# EAGLE design Esp8266_prot16_v2 (EAGLE 8.4.0)
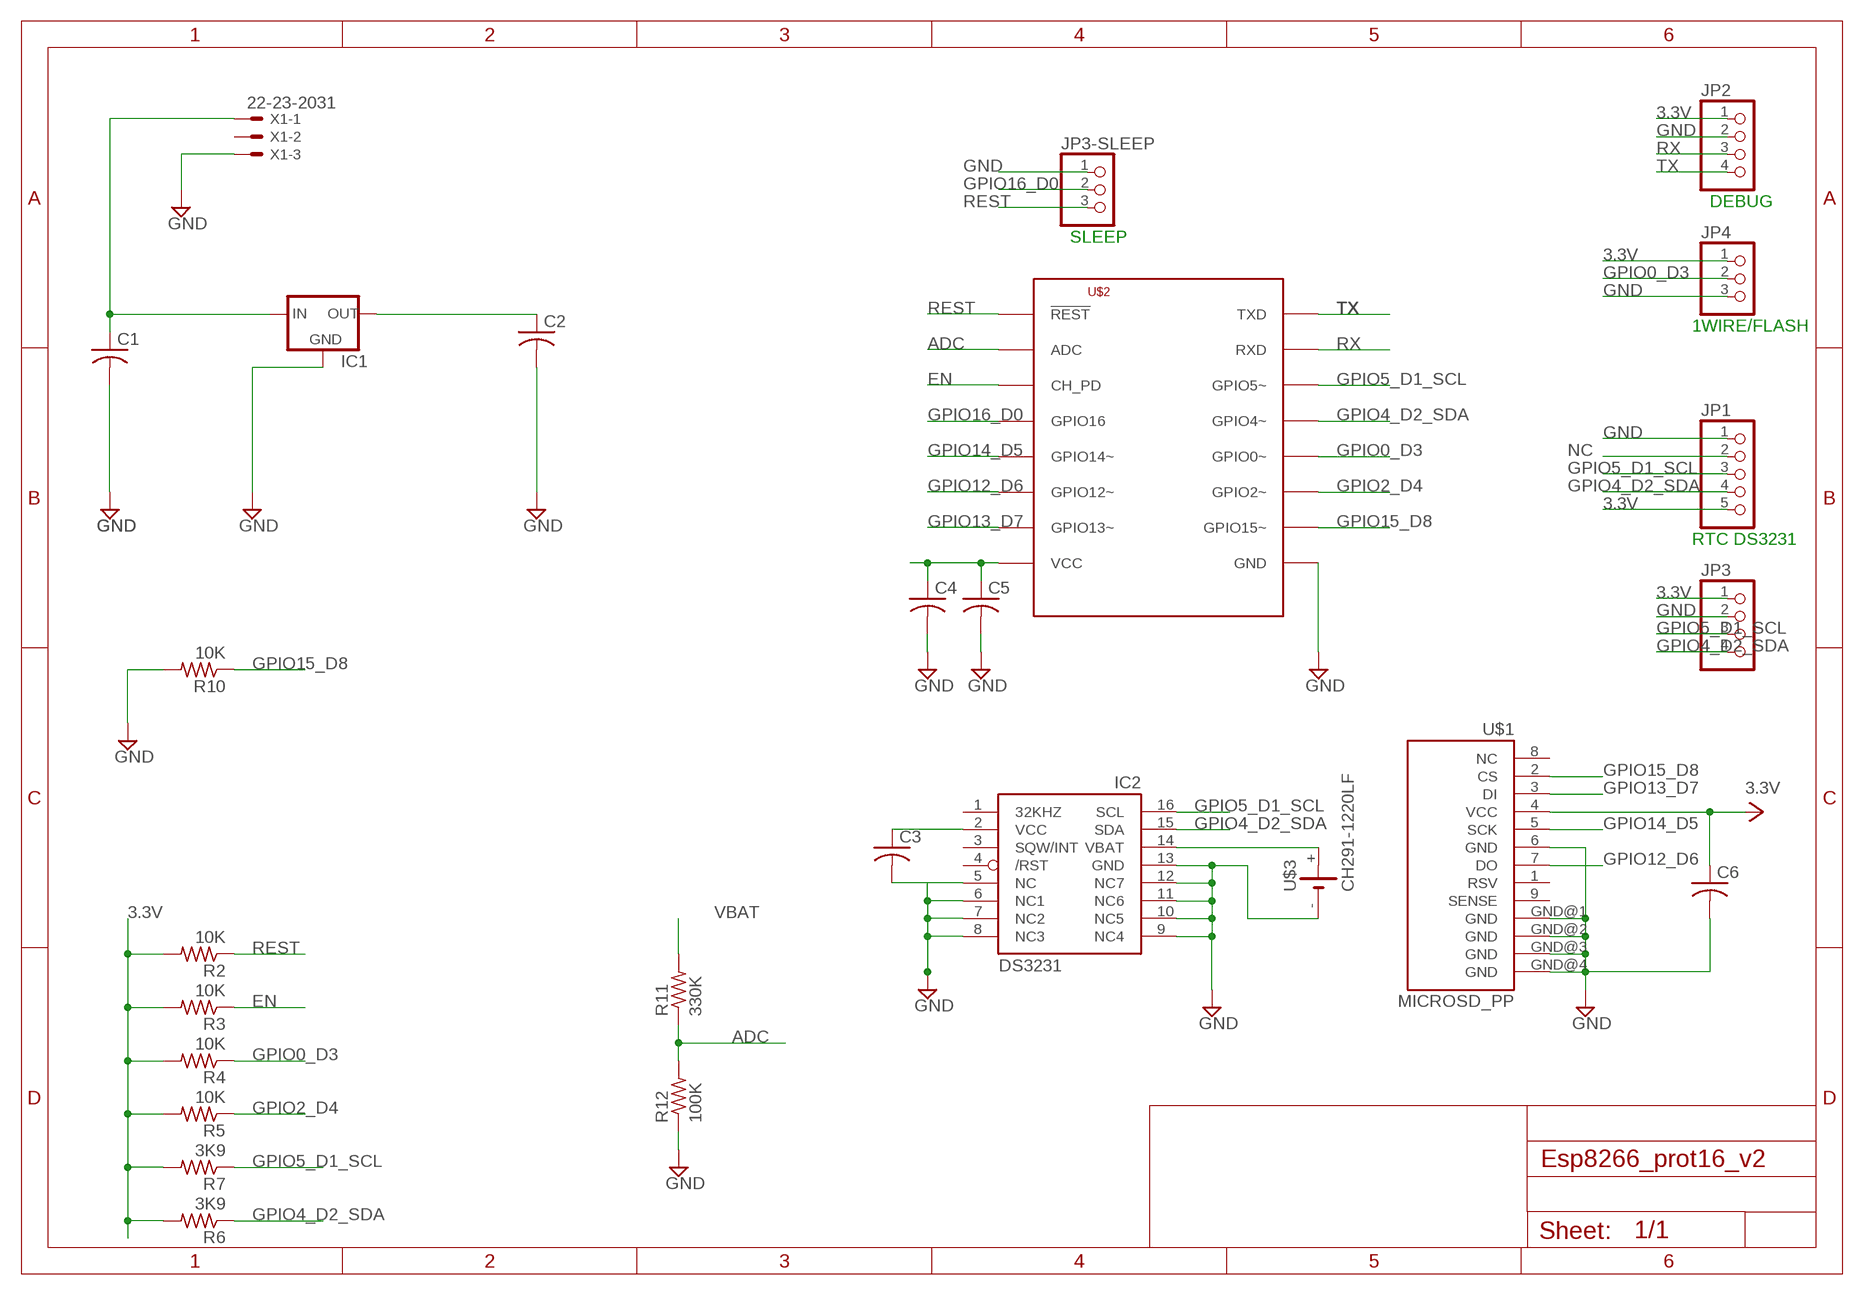
[diagram p0: schematic, sheet 1]

## Parts
C1  C-USC0805K  [C0805K]
C2  C-USC0805K  [C0805K]
C3  C-USC0805K  [C0805K]
C4  C-USC0805K  [C0805K]
C5  C-USC0805K  [C0805K]
C6  C-USC0805K  [C0805K]
IC1  XC63FPP  [SOT89R]
IC2  DS3231/SO  [SO16W]
JP1  PINHD-1X5/90  [1X05/90]
JP2  PINHD-1X4  [1X04]
JP3  PINHD-1X4/90  [1X04/90]
JP3-SLEEP  PINHD-1X3  [1X03]
JP4  PINHD-1X3  [1X03]
R2  10K  R-US_R0805  [R0805]
R3  10K  R-US_R0805  [R0805]
R4  10K  R-US_R0805  [R0805]
R5  10K  R-US_R0805  [R0805]
R6  3K9  R-US_R0805  [R0805]
R7  3K9  R-US_R0805  [R0805]
R10  10K  R-US_R0805  [R0805]
R11  330K  R-US_R0805  [R0805]
R12  100K  R-US_R0805  [R0805]
U$1  MICROSD_PP  [MICROSD_PP]
U$2  ESP8266-07  [ESP-07]
U$3  CH291-1220LF  [CH291-1220LF]
X1  22-23-2031  [22-23-2031]

## Nets
3.3V: C2.1 C3.1 C4.1 C5.1 C6.1 IC1.3(OUT) IC2.2(VCC) JP1.5 JP2.1 JP3.1 JP4.1 R2.2 R3.2 R4.2 R5.2 R6.2 R7.2 U$1.4(VCC) U$2.VCC
ADC: R11.1 R12.2 U$2.ADC
BATRTC: IC2.14(VBAT) U$3.+
EN: R3.1 U$2.CH_PD
GND: C1.2 C2.2 C3.2 C4.2 C5.2 C6.2 IC1.1(GND) IC2.5(NC) IC2.6(NC1) IC2.7(NC2) IC2.8(NC3) IC2.9(NC4) IC2.10(NC5) IC2.11(NC6) IC2.12(NC7) IC2.13(GND) JP1.1 JP2.2 JP3-SLEEP.1 JP3.2 JP4.3 R10.2 R12.1 U$1.6(GND) U$1.GND@1(GND) U$1.GND@2(GND) U$1.GND@3(GND) U$1.GND@4(GND) U$2.GND U$3.- X1.3
GPIO0_D3: JP4.2 R4.1 U$2.GPIO0(GPIO0~)
GPIO2_D4: R5.1 U$2.GPIO2(GPIO2~)
GPIO4_D2_SDA: IC2.15(SDA) JP1.4 JP3.4 R6.1 U$2.GPIO5(GPIO4~)
GPIO5_D1_SCL: IC2.16(SCL) JP1.3 JP3.3 R7.1 U$2.GPIO4(GPIO5~)
GPIO12_D6: U$1.7(DO) U$2.GPIO12(GPIO12~)
GPIO13_D7: U$1.3(DI) U$2.GPIO13(GPIO13~)
GPIO14_D5: U$1.5(SCK) U$2.GPIO14(GPIO14~)
GPIO15_D8: R10.1 U$1.2(CS) U$2.GPIO15(GPIO15~)
GPIO16_D0: JP3-SLEEP.2 U$2.GPIO16
NC: JP1.2
REST: JP3-SLEEP.3 R2.1 U$2.REST(!REST)
RX: JP2.3 U$2.RXD
TX: JP2.4 U$2.TXD
VBAT: C1.1 IC1.2(IN) R11.2 X1.1
Unconnected: IC2.1(32KHZ) IC2.3(SQW/INT) IC2.4(/RST) U$1.1(RSV) U$1.8(NC) U$1.9(SENSE) X1.2

## Notes on the sheet
- DEBUG
- SLEEP
- 1WIRE/FLASH
- RTC DS3231

## Library data of the parts
C1-C6 = adafruit:C-US: CAPACITOR, American symbol
IC1 = v-reg:XC63FP: Positiv Voltage Regulators www.torex.co.jp/english/product/pro02/pdf/0201_xc62fp.pdf
IC2 = adafruit:DS3231
JP1 = pinhead:PINHD-1X5: PIN HEADER
JP2 JP3 = pinhead:PINHD-1X4: PIN HEADER
JP3-SLEEP JP4 = pinhead:PINHD-1X3: PIN HEADER
R2-R7 R10-R12 = adafruit:R-US_: RESISTOR, American symbol
U$1 = DE1594-v2:MICROSD_PP
U$2 = lio:ESP8266
U$3 = battery:CH291-1220LF: Battery Holder, SMT, 12mm multicomp PART NO. CH291-1220LF Source: Data sheet <http://www.farnell.com/datasheets/1505860.pdf>
X1 = con-molex:22-23-2031: .100" (2.54mm) Center Header - 3 Pin; MF: MOLEX; MPN: 22-23-2031; OC_FARNELL: 1462950; OC_NEWARK: 30C0862

## Board
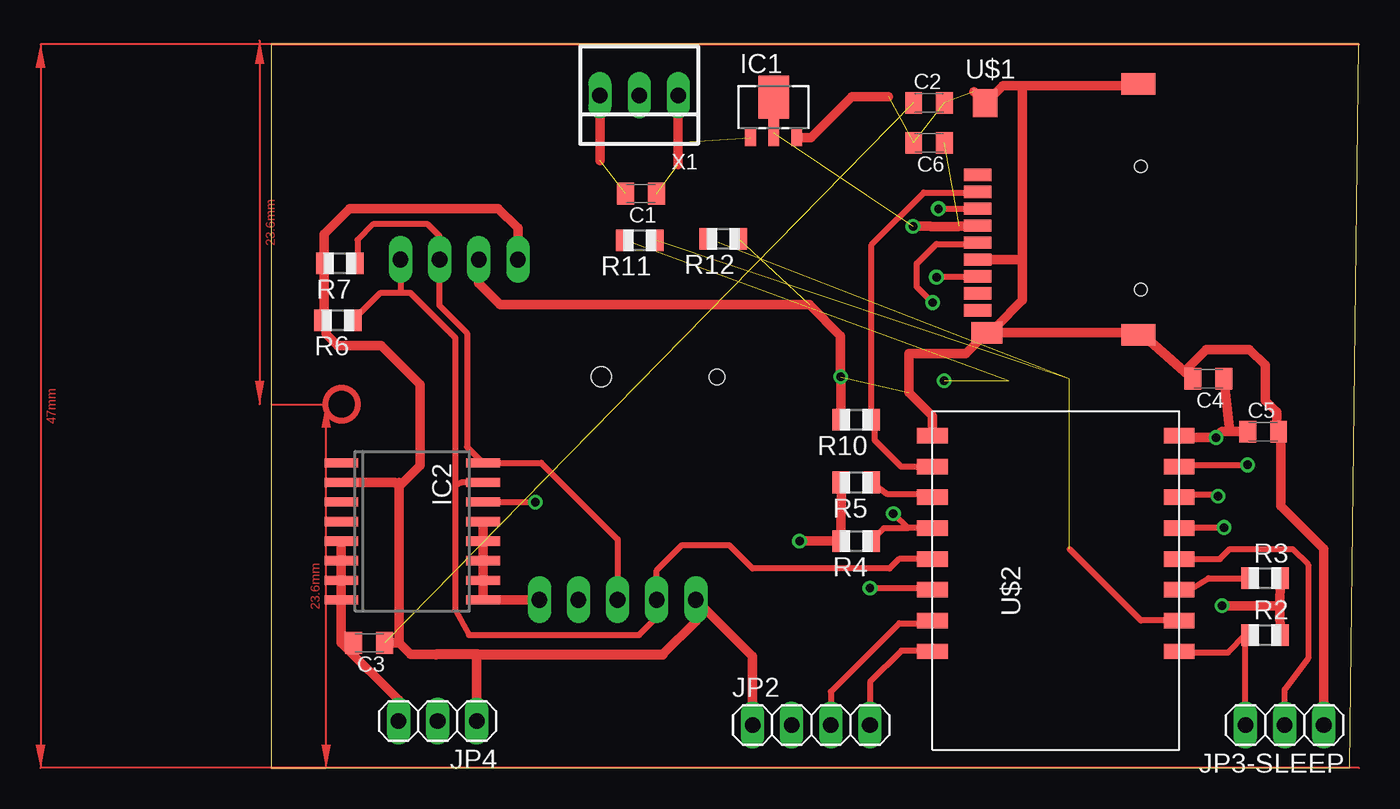
[diagram p1: board, top side]
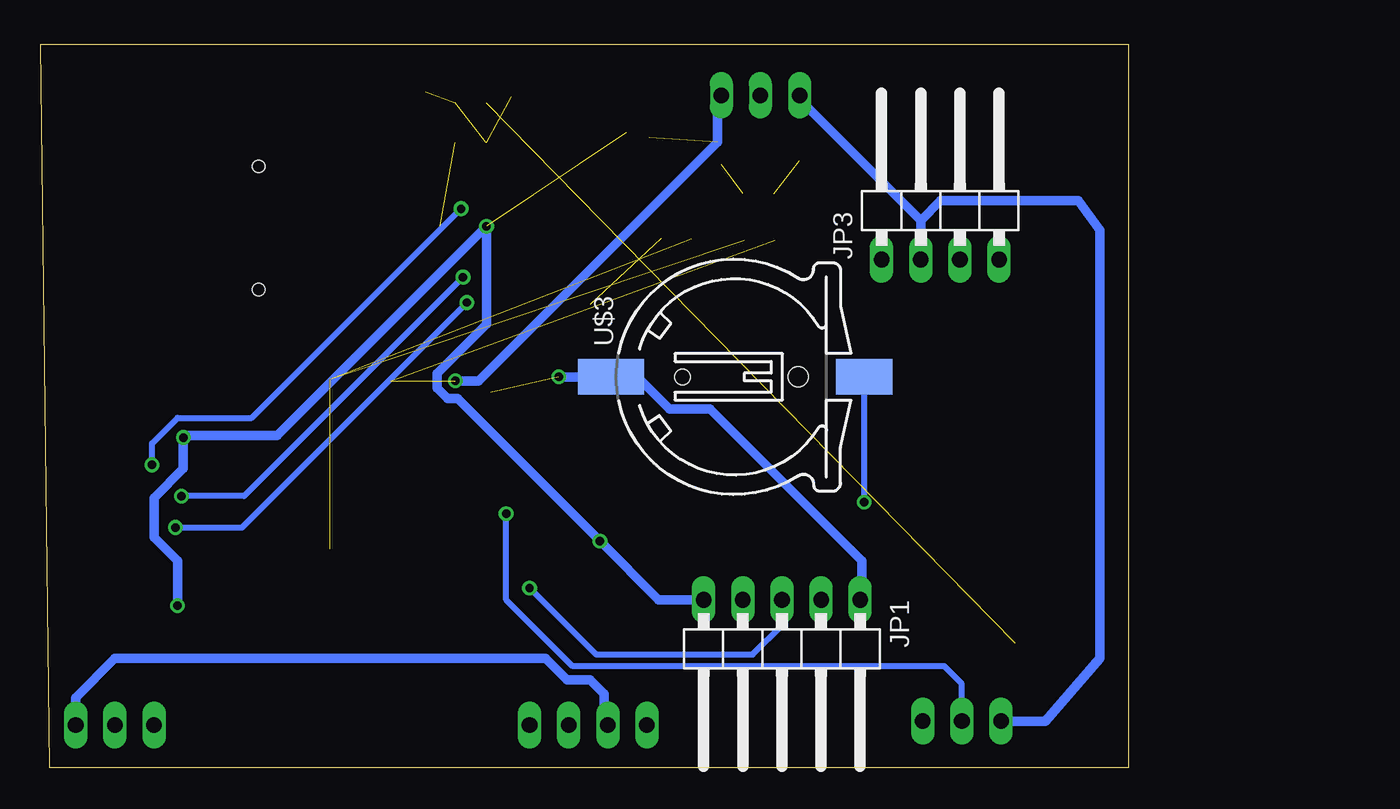
[diagram p2: board, bottom side, seen from below]

Size 70.6 x 47 mm. Coordinates in mm from the lower left corner, seen from the top.
Outline: 0,0 70,0 70.6,47 0,47 0,0
Copper layers (1*16): Top 0.035mm / dielectric 1.5mm / Bottom 0.035mm
Design rules "default *": minimum track width 15mil, minimum drill 0.55mm, track to track 15mil, track to pad 15mil, pad to pad 6mil, via to via 6mil, smd to smd 6mil, copper to edge 50mil, drill to drill 6mil, minimum pad ring 10mil, minimum via ring 8mil, stop-mask expansion 4mil, vias tented up to drill 0mil, thermal gap 10mil

### Footprints (pad centres in the part's own frame; a part is rotated, then mirrored left to right if it is on the bottom)
C0805K = smd 1.1 x 1.4: 1 -1,0; 2 1,0
SOT89R = smd 0.7 x 1.1: 1 1.5,-1.75; 2 -1.5,-1.75 | smd 0.7 x 1.8: 3 0,-1.4 | smd 2 x 2.8: 4 0,0.9
SO16W = smd 0.6 x 2.2: 1 -4.445,-4.6; 2 -3.175,-4.6; 3 -1.905,-4.6; 4 -0.635,-4.6; 5 0.635,-4.6; 6 1.905,-4.6; 7 3.175,-4.6; 8 4.445,-4.6; 9 4.445,4.6; 10 3.175,4.6; 11 1.905,4.6; 12 0.635,4.6; 13 -0.635,4.6; 14 -1.905,4.6; 15 -3.175,4.6; 16 -4.445,4.6
1X05/90 = drill 1.016 long: 1 -5.08,-3.81; 2 -2.54,-3.81; 3 0,-3.81; 4 2.54,-3.81; 5 5.08,-3.81
1X04 = drill 1.016 long: 1 -3.81,0; 2 -1.27,0; 3 1.27,0; 4 3.81,0
1X04/90 = drill 1.016 long: 1 -3.81,-3.81; 2 -1.27,-3.81; 3 1.27,-3.81; 4 3.81,-3.81
1X03 = drill 1.016 long: 1 -2.54,0; 2 0,0; 3 2.54,0
R0805 = smd 1.1 x 1.4: 1 -1,0; 2 1,0
MICROSD_PP = smd 1.8 x 0.8: 1 0,3.85; 2 0,2.75; 3 0,1.65; 4 0,0.55; 5 0,-0.55; 6 0,-1.65; 7 0,-2.75; 8 0,-3.85; 9 0,-4.95 | smd 1.6 x 1.8: GND@1 0.5,8.5 | smd 2.2 x 1.4: GND@2 10.45,9.75; GND@4 10.45,-6.55 | smd 2 x 1.4: GND@3 0.6,-6.4 | hole 0.8: 10.6,4.4; 10.6,-3.6
ESP-07 = smd 1 x 2: ADC -1.6,-8; CH_PD 0.4,-8; GND 10.4,8; GPIO0 4.4,8; GPIO2 6.4,8; GPIO4 0.4,8; GPIO5 2.4,8; GPIO12 6.4,-8; GPIO13 8.4,-8; GPIO14 4.4,-8; GPIO15 8.4,8; GPIO16 2.4,-8; REST -3.6,-8; RXD -1.6,8; TXD -3.6,8; VCC 10.4,-8
CH291-1220LF = smd 2.3 x 3.66: + 0,-2.296 | smd 2.3 x 4.3: - 0,14.146 | hole 1.3: 0,2 | hole 1: 0,9.5
22-23-2031 = drill 1 long: 1 -2.54,0; 2 0,0; 3 2.54,0

### Placement (x,y rotation side)
C1  24,37.3 180 top
C2  42.7,43.2 0 top
C3  6.35,8.13 180 top
C4  60.83,25.27 180 top
C5  64.39,21.84 0 top
C6  42.7,40.6 180 top
IC1  32.61,42.67 0 top
IC2  9.14,15.37 270 top
JP1  22.48,7.11 180 bottom
JP2  35.05,2.79 0 top
JP3  12.19,36.83 0 bottom
JP3-SLEEP  65.79,2.79 180 top
JP4  10.79,3.05 180 top
R2  64.52,8.64 0 top
R3  64.52,12.32 0 top
R4  37.97,14.73 180 top
R5  37.97,18.54 180 top
R6  4.32,29.08 180 top
R7  4.45,32.77 180 top
R10  37.97,22.61 180 top
R11  23.92,34.27 180 top
R12  29.34,34.37 180 top
U$1  45.85,34.67 0 top
U$2  50.93,11.18 90 top
U$3  19.43,25.4 90 bottom
X1  23.88,43.69 180 top

### Tracks (layer width: path | path; a pad name or v marks a point on that pad's centre or on a via)
3.3V  (via drill 0.55)  (3 unrouted)
  Top 0.381: 3.43,29.34 R6.2 | 3.43,32.77 R7.2 3.81,32.77 | 59.31,21.46 U$2.VCC | U$1.4 45.59,35.18 | 65.47,10.35 65.28,10.54
  Top 0.61: 3.43,29.34 3.43,32.77 3.43,34.67 5.08,36.32 14.73,36.32 16,35.05 JP3.1 | 59.31,21.46 v61.34,21.46 61.72,21.84 62.23,21.84 | v61.72,10.54 65.28,10.54 65.34,10.54 | R6.2 3.56,28.84 3.56,28.19 4.32,27.43 7.11,27.43 9.65,24.89 9.65,19.66 8.28,18.29 | 8.28,18.29 8.28,8.13 | 8.28,18.29 8.28,18.54 | v34.29,14.73 R4.2 37.02,18.49 R5.2 | R2.2 65.47,10.35 R3.2 | 62.23,21.84 C5.1 | v41.66,35.18 42.8,35.18 42.83,35.16 44.61,35.16 44.66,35.21 45.83,35.21 U$1.4 | C4.1 62.23,21.85 62.23,21.84 | C3.1 8.28,8.13 | IC2.2 8.03,18.54 8.28,18.29 | JP2.1 31.24,7.24 JP1.5 27.56,9.53 25.4,7.37 | 8.28,8.13 9.04,7.37 10.67,7.37 | JP4.1 13.34,7.24 13.46,7.37
  Top 0.635: 10.67,7.37 13.46,7.37 25.4,7.37
  Bottom 0.381: 61.47,21.21 v61.34,21.46 61.09,21.59 | v34.29,14.73 34.18,14.85 | 41.52,28.96 41.66,28.82
  Bottom 0.61: 61.09,21.59 55.24,21.59 v41.66,35.18 41.66,28.82 44.85,25.63 44.85,24.66 44.17,23.98 43.54,23.98 v34.29,14.73 30.48,10.92 JP1.5 | v61.34,21.46 61.34,19.45 63.25,17.55 63.25,14.99 61.72,13.46 v61.72,10.54
ADC  (3 unrouted)
  Top 0.381: U$2.ADC 56.46,9.58 51.82,14.22
BATRTC  (via drill 0.55)
  Top 0.381: IC2.14 16,17.27 v17.14,17.26
  Bottom 0.381: v17.14,17.26 U$3.+
EN
  Top 0.381: R3.1 60.83,12.32 59.18,11.3 U$2.CH_PD
GND  (via drill 0.55)  (6 unrouted)
  Top 0.381: U$1.GND@1 45.97,43.18 | 43.18,21.59 U$2.GND | U$1.GND@3 46.35,27.94 | 56.64,27.94 U$1.GND@4 | 36.96,23.11 36.97,23.1
  Top 0.61: 48.77,44.32 47.5,44.32 U$1.GND@1 45.6,43.92 | U$1.GND@3 56.15,28.27 U$1.GND@4 | U$1.GND@3 46.81,28.64 47.03,28.64 48.77,30.37 48.77,33.02 | 48.77,33.02 48.77,44.32 | U$1.6 48.77,33.02 | IC2.13 IC2.12 IC2.11 IC2.10 IC2.9 JP1.1 | IC2.5 IC2.6 IC2.7 IC2.8 4.54,8.13 | 48.77,44.32 56.2,44.32 U$1.GND@2 | 21.34,39.44 X1.3 | U$2.GND 42.93,22.86 41.4,24.38 41.4,26.92 45.1,26.92 U$1.GND@3 | JP3-SLEEP.1 68.33,14.22 65.53,17.02 65.53,21.7 C5.2 65.28,21.95 65.28,23.11 64.52,23.88 64.52,26.16 63.5,27.18 60.71,27.18 59.43,25.91 C4.2 56.77,27.94 56.64,27.94 | C3.2 4.54,8.13 | 36.97,22.37 R10.2 36.97,23.1 36.97,25.38 v36.96,25.4 36.96,28.07 34.93,30.1 14.86,30.1 13.46,31.5 JP3.2 | JP4.3 8.26,4.42 4.54,8.13 | IC1.1 35.02,40.92 37.7,43.6 40.07,43.6
  Bottom 0.61: U$3.- v36.96,25.4 31.86,25.4 29.79,23.32 27.14,23.32 17.27,13.46 17.27,11.05 JP1.1 | JP3.2 13.46,35.56 | 13.46,35.56 20.83,42.93 X1.3 | 13.46,35.56 12.19,36.83 3.23,36.83 1.83,34.92 1.83,7.11 5.38,3.05 JP4.3 | JP2.2 34.04,3.05 34.04,4.83 34.94,5.73 36.43,5.73 37.81,7.11 65.79,7.11 68.33,4.57 JP3-SLEEP.1
GPIO0_D3  (via drill 0.55)
  Top 0.381: 42.8,15.49 U$2.GPIO0 41.32,15.58 | 38.86,14.67 R4.1 39.77,15.58 41.32,15.58 | v40.39,16.51 41.32,15.58
  Bottom 0.381: 10.79,4.32 JP4.2 10.79,5.46 11.94,6.6 36.07,6.6 40.39,10.92 v40.39,16.51
GPIO2_D4
  Top 0.381: R5.1 40.01,17.78 42.8,17.78 U$2.GPIO2
GPIO4_D2_SDA
  Top 0.381: 5.33,29.34 R6.1 7.1,30.86 8.38,30.86 | 8.38,30.86 9.02,30.86 11.94,27.94 11.94,18.29 | 11.94,18.29 11.94,10.29 12.83,8.64 23.88,8.64 25.02,9.78 JP1.4 25.02,12.83 26.67,14.48 29.72,14.48 31.24,12.95 40.13,12.95 40.75,13.58 U$2.GPIO5 | 11.94,18.29 12.32,18.54 IC2.15 | JP3.4 8.38,30.86
GPIO5_D1_SCL  (via drill 0.55)
  Top 0.381: v38.86,11.68 42.8,11.68 U$2.GPIO4 | 5.59,32.77 5.71,32.77 | 5.59,32.77 R7.1 | 5.59,32.77 5.59,34.29 6.6,35.31 10.16,35.31 10.92,34.54 JP3.3 10.92,30.03 12.7,28.26 12.7,20.86 IC2.16 17.53,19.81 22.48,14.86 JP1.3
  Bottom 0.381: v38.86,11.68 34.54,7.37 24.38,7.37 22.48,9.27 JP1.3
GPIO12_D6  (via drill 0.55)
  Top 0.381: v61.47,17.65 61.47,17.78 59.18,17.78 U$2.GPIO12 | v43.18,31.88 43.48,31.92 U$1.7
  Bottom 0.381: v43.18,31.88 57.4,17.65 v61.47,17.65
GPIO13_D7  (via drill 0.55)
  Top 0.381: v63.37,19.68 59.18,19.68 U$2.GPIO13 | 45.97,36.32 U$1.3 v43.31,36.32
  Bottom 0.381: v43.31,36.32 56.9,22.73 61.72,22.73 63.37,21.08 v63.37,19.68
GPIO14_D5  (via drill 0.55)
  Top 0.381: U$1.5 45.59,34.04 43.18,34.04 41.91,32.77 41.91,31.24 v42.93,30.23 | v61.85,15.62 61.8,15.58 U$2.GPIO14
  Bottom 0.381: v42.93,30.23 57.53,15.62 v61.85,15.62
GPIO15_D8
  Top 0.381: U$1.2 45.59,37.47 45.5,37.37 42.36,37.37 38.97,33.98 R10.1 39.17,22.41 39.17,21.28 40.89,19.56 42.91,19.56 U$2.GPIO15
GPIO16_D0
  Top 0.381: U$2.GPIO16 61.58,13.58 62.23,14.22 66.29,14.22 67.31,13.21 67.31,7.11 65.79,5.08 JP3-SLEEP.2
REST
  Top 0.381: U$2.REST 59.18,7.49 62.1,7.49 63.25,8.64 | 63.25,8.64 R2.1 | JP3-SLEEP.3 63.25,8.64
RX
  Top 0.381: U$2.RXD 42.8,9.4 40.77,9.4 36.32,4.95 JP2.3
TX
  Top 0.381: 42.8,7.49 U$2.TXD 42.88,7.62 40.89,7.62 38.86,5.59 JP2.4
VBAT  (via drill 0.55)  (4 unrouted)
  Top 0.61: 26.42,39.18 X1.1
  Bottom 0.61: v43.69,25.15 42.16,25.15 26.67,40.64 26.67,42.67 X1.1
(copper drawn outside any net)
  shapes: Top area x4, Top circle x1